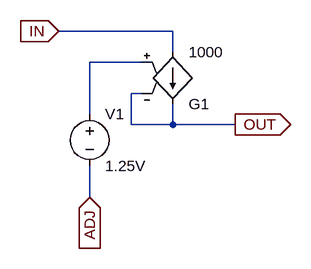
[diagram p0: schematic IdealPosRegulator.asc]
IdealPosRegulator.asc, the LTspice schematic file:
Version 4
SHEET 1 880 680
WIRE 192 80 16 80
WIRE 192 112 192 80
WIRE 144 128 64 128
WIRE 144 176 128 176
WIRE 64 208 64 128
WIRE 128 224 128 176
WIRE 192 224 192 192
WIRE 192 224 128 224
WIRE 288 224 192 224
WIRE 64 336 64 288
FLAG 16 80 IN
IOPIN 16 80 In
FLAG 288 224 OUT
IOPIN 288 224 Out
FLAG 64 336 ADJ
IOPIN 64 336 In
SYMBOL g2 192 208 M180
SYMATTR InstName G1
SYMATTR Value 1000
SYMBOL voltage 64 192 R0
SYMATTR InstName V1
SYMATTR Value 1.25V

The netlist it stands for:
* IdealPosRegulator.asc
G1 IN OUT N001 OUT 1000
V1 N001 ADJ 1.25V
.backanno
.end